# Altium schematic sheet Ideal Diode (B).SchDoc
size A4; SheetNumber: 10; SheetTotal: 10
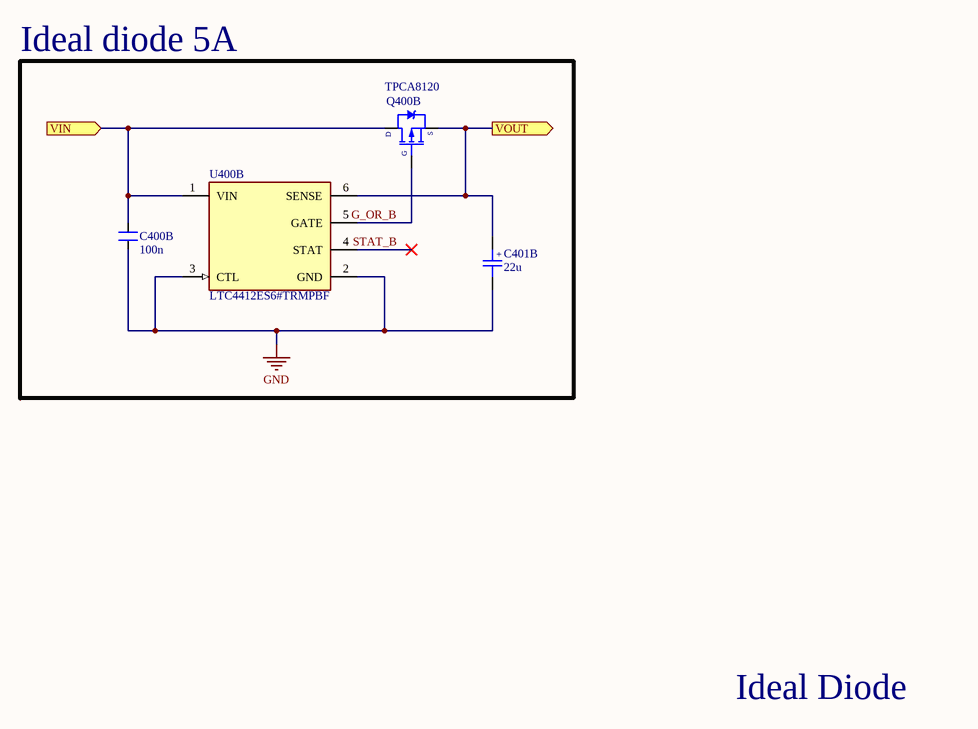
[diagram p0: Ideal Diode (B).SchDoc]

## Parts
C400B  100n  [CN-SMD-0603]
C401B  22u  [CAP_TANT_0603]
Q400B  TPCA8120  [Mosfet P channel]
U400B  LTC4412ES6#TRMPBF  [FP-S6-6-05-08-1636-IPC_C]

## Blocks framed on the sheet
Ideal diode 5A: C400B C401B Q400B U400B

## Ports
VIN (in, see BD[3B]), VOUT (out, see BD[3B])

## Nets
GND: C400B.1 C401B.K U400B.2(GND) U400B.3(CTL)
G_OR_B: Q400B.4(G) U400B.5(GATE)
STAT_B: U400B.4(STAT)
VIN: C400B.2 Q400B.5,6,7,8(D) U400B.1(VIN) ; port VIN
VOUT: C401B.A Q400B.1,2,3(S) U400B.6(SENSE) ; port VOUT

## Notes on the sheet
- Ideal Diode
- (in symbol CAP_TANT_0603) +

## Library data of the parts
C400B = CN: Value: 33pF
C401B = CAP_TANT_0603: Capacitor SMD Tantalum 0603; Manufacturer: *; Manufacturer Part Number: *; Distributor Link: *; LCSC: *
Q400B = Mosfet P channel
U400B = CMP-0479-00425-2: IC OR CTRLR SRC SELECT TSOT23-6; Min Supply Voltage: 2.5V; Max Supply Voltage: 28V; Turn-On Delay Time: 110us; Number of Channels: 1; Lead Free: Lead Free; Length: 2.9mm; Radiation Hardening: No; RoHS Compliant: Yes; Package Quantity: 1; Min Operating Temperature: -40°C; Series: PowerPath™; Packaging: Tape and Reel; Width: 1.75mm; Height: 0.9mm; Number of Pins: 6; Max Operating Temperature: 85°C; Number of Outputs: 1; Case/Package: TSOT; REACH SVHC: No SVHC